# Altium schematic sheet Positive_Schematic.SchDoc
size A4; SheetNumber: 1; SheetTotal: 1
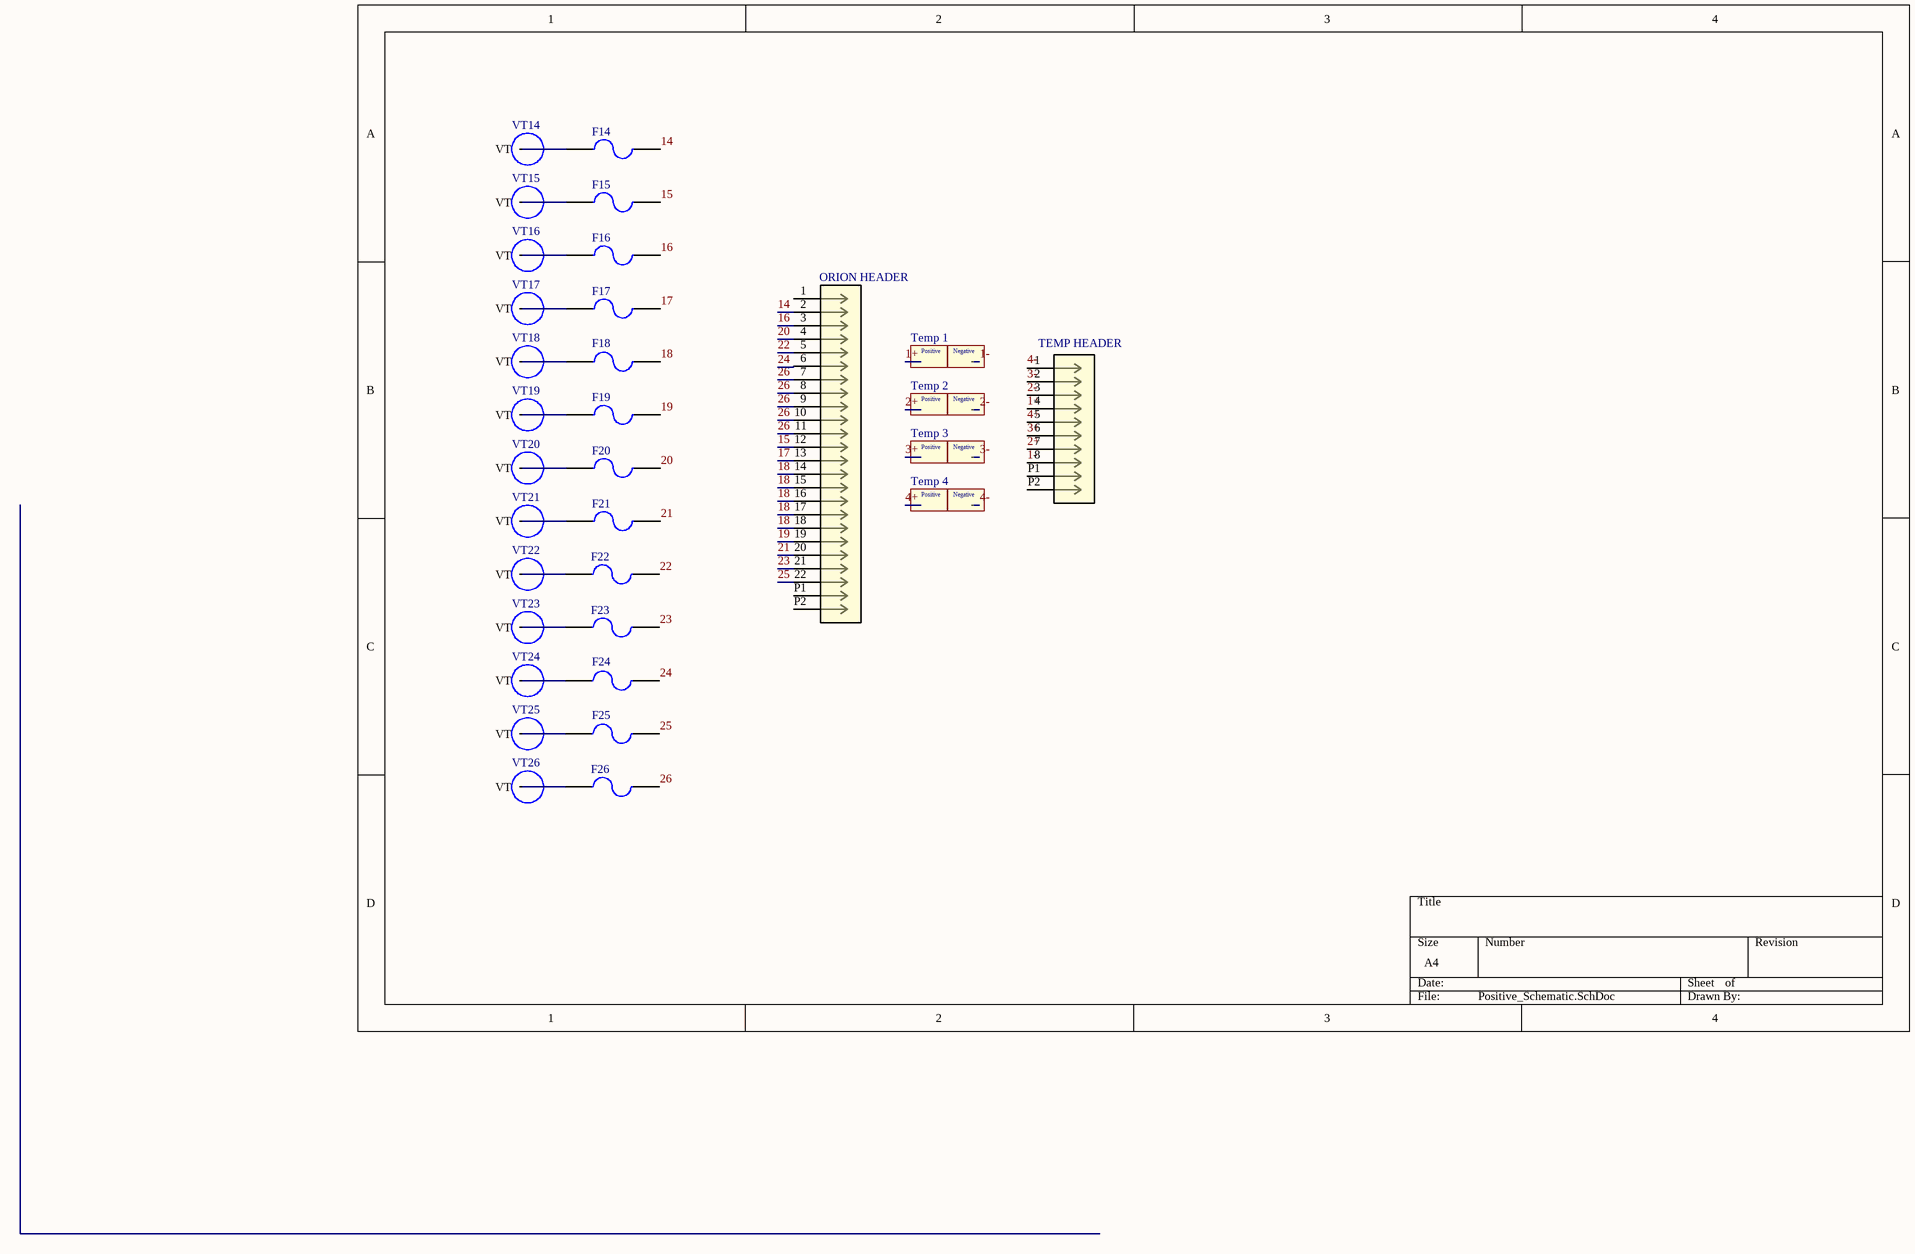
[diagram p0: Positive_Schematic.SchDoc]

## Parts
F14  0154.750MRL  [0451Series_LTF]  (value not drawn)
F15  0154.750MRL  [0451Series_LTF]  (value not drawn)
F16  0154.750MRL  [0451Series_LTF]  (value not drawn)
F17  0154.750MRL  [0451Series_LTF]  (value not drawn)
F18  0154.750MRL  [0451Series_LTF]  (value not drawn)
F19  0154.750MRL  [0451Series_LTF]  (value not drawn)
F20  0154.750MRL  [0451Series_LTF]  (value not drawn)
F21  0154.750MRL  [0451Series_LTF]  (value not drawn)
F22  0154.750MRL  [0451Series_LTF]  (value not drawn)
F23  0154.750MRL  [0451Series_LTF]  (value not drawn)
F24  0154.750MRL  [0451Series_LTF]  (value not drawn)
F25  0154.750MRL  [0451Series_LTF]  (value not drawn)
F26  0154.750MRL  [0451Series_LTF]  (value not drawn)
ORION_HEADER  430452215  [CON_430452215_MOL]  (value not drawn)
Temp_1  Temp_Pins  [TEMP_PINS]  (value not drawn)
Temp_2  temp 2  [TEMP_PINS]  (value not drawn)
Temp_3  Temp_Pins  [TEMP_PINS]  (value not drawn)
Temp_4  Temp_Pins  [TEMP_PINS]  (value not drawn)
TEMP_HEADER  430450815  [CON_430450815_MOL]  (value not drawn)
VT14  Voltage_Tap  [VOLTAGE_TAP]  (value not drawn)
VT15  Voltage_Tap  [VOLTAGE_TAP]  (value not drawn)
VT16  Voltage_Tap  [VOLTAGE_TAP]  (value not drawn)
VT17  Voltage_Tap  [VOLTAGE_TAP]  (value not drawn)
VT18  Voltage_Tap  [VOLTAGE_TAP]  (value not drawn)
VT19  Voltage_Tap  [VOLTAGE_TAP]  (value not drawn)
VT20  Voltage_Tap  [VOLTAGE_TAP]  (value not drawn)
VT21  Voltage_Tap  [VOLTAGE_TAP]  (value not drawn)
VT22  Voltage_Tap  [VOLTAGE_TAP]  (value not drawn)
VT23  Voltage_Tap  [VOLTAGE_TAP]  (value not drawn)
VT24  Voltage_Tap  [VOLTAGE_TAP]  (value not drawn)
VT25  Voltage_Tap  [VOLTAGE_TAP]  (value not drawn)
VT26  Voltage_Tap  [VOLTAGE_TAP]  (value not drawn)

## Nets
1+: Temp_1.1+ TEMP_HEADER.4
1-: Temp_1.1- TEMP_HEADER.8
2+: Temp_2.1+ TEMP_HEADER.7
2-: Temp_2.1- TEMP_HEADER.3
3+: Temp_3.1+ TEMP_HEADER.6
3-: Temp_3.1- TEMP_HEADER.2
4+: Temp_4.1+ TEMP_HEADER.5
4-: Temp_4.1-
14: F14.2 ORION_HEADER.2
15: F15.2 ORION_HEADER.12
16: F16.2 ORION_HEADER.3
17: F17.2 ORION_HEADER.13
18: F18.2 ORION_HEADER.14 ORION_HEADER.15 ORION_HEADER.16 ORION_HEADER.17 ORION_HEADER.18
19: F19.2 ORION_HEADER.19
20: F20.2 ORION_HEADER.4
21: F21.2 ORION_HEADER.20
22: F22.2 ORION_HEADER.5
23: F23.2 ORION_HEADER.21
24: F24.2 ORION_HEADER.6
25: F25.2 ORION_HEADER.22
26: F26.2 ORION_HEADER.7 ORION_HEADER.8 ORION_HEADER.9 ORION_HEADER.10 ORION_HEADER.11
NetF14_1: F14.1 VT14.1(VT)
NetF15_1: F15.1 VT15.1(VT)
NetF16_1: F16.1 VT16.1(VT)
NetF17_1: F17.1 VT17.1(VT)
NetF18_1: F18.1 VT18.1(VT)
NetF19_1: F19.1 VT19.1(VT)
NetF20_1: F20.1 VT20.1(VT)
NetF21_1: F21.1 VT21.1(VT)
NetF22_1: F22.1 VT22.1(VT)
NetF23_1: F23.1 VT23.1(VT)
NetF24_1: F24.1 VT24.1(VT)
NetF25_1: F25.1 VT25.1(VT)
NetF26_1: F26.1 VT26.1(VT)

Not connected (* = marked no-connect by the designer): ORION_HEADER 1 P1 P2; TEMP_HEADER 1 P1 P2

## Notes on the sheet
- Labels drawn without touching a wire or pin: 4-
- (in symbol Temp_Pins) Positive; Negative

## Library data of the parts
F14-F26 = 0154.750MRL: FUSE BOARD MNT 750MA 125VAC/VDC; Manufacturer: Littelfuse Inc.; Part Number: 0154.750MRL; Digikey Part Number: F2576CT-ND; Digikey Link: https://www.digikey.com.au/en/products/detail/littelfuse-inc/0451-750MRL/700816
ORION_HEADER = 430452215: No Description Available; Mfr_Name: Molex Connector Corporation; RefDes: RefDes; Type: Type
Temp_2 = Temp_Pins
TEMP_HEADER = 430450815: No Description Available; Mfr_Name: Molex Connector Corporation; RefDes: RefDes; Type: Type
VT14-VT26 = Voltage Tap: Positions: 1; Pitch: 0mm; Angle: 0; Flange: No; Contact: NA; Part Number: Voltage Tap; Row Spacing: 0mm